# EAGLE schematic untitled (EAGLE 7.7.0)
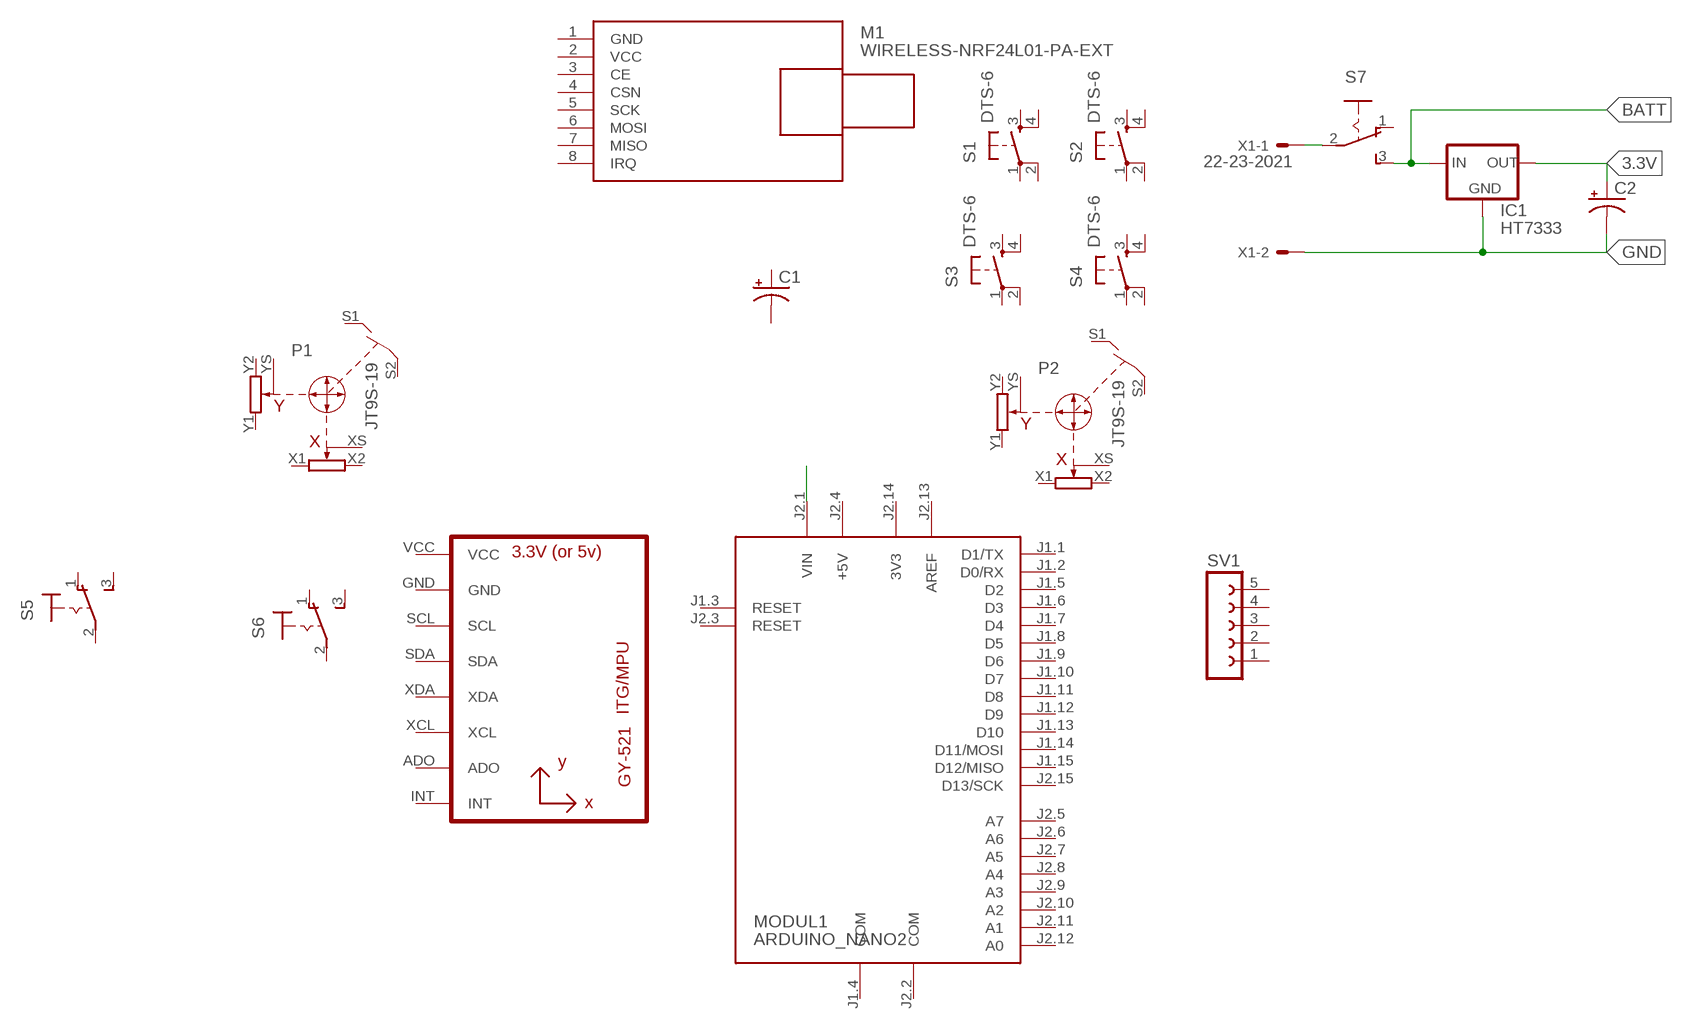
[diagram p0: schematic, sheet 1]

## Parts
C1  CPOL-USE5-8.5  [E5-8,5]
C2  CPOL-USE5-8.5  [E5-8,5]
IC1  HT7333  [SOT-89]
M1  WIRELESS-NRF24L01-PA-EXT  [WIRELESS-NRF24L01-PA-EXT]
MODUL1  ARDUINO_NANO2  [ARDUINO_NANO2]
P1  JT9S-19  [JT9S-1P]
P2  JT9S-19  [JT9S-1P]
S1  DTS-6  [DTS-6]
S2  DTS-6  [DTS-6]
S3  DTS-6  [DTS-6]
S4  DTS-6  [DTS-6]
S5  320-916  [320-916]
S6  320-916  [320-916]
S7  255SB  [255SB]
SV1  FE05-1  [FE05-1]
U1  GY-521MPU6050  [GY-521]
X1  22-23-2021  [22-23-2021]

## Nets
3.3V: C2.+ IC1.1(OUT)
BATT: IC1.3(IN) IC1.4(IN) S7.3(S)
GND: C2.- IC1.2(GND) X1.2
N$1: S7.2(P) X1.1
N$2: MODUL1.J2.1(VIN)
Unconnected: C1.+ C1.- M1.3(CE) M1.4(CSN) M1.5(SCK) M1.6(MOSI) M1.7(MISO) M1.8(IRQ) MODUL1.J1.1(D1/TX) MODUL1.J1.2(D0/RX) MODUL1.J1.3(RESET) MODUL1.J1.5(D2) MODUL1.J1.6(D3) MODUL1.J1.7(D4) MODUL1.J1.8(D5) MODUL1.J1.9(D6) MODUL1.J1.10(D7) MODUL1.J1.11(D8) MODUL1.J1.12(D9) MODUL1.J1.13(D10) MODUL1.J1.14(D11/MOSI) MODUL1.J1.15(D12/MISO) MODUL1.J2.3(RESET) MODUL1.J2.5(A7) MODUL1.J2.6(A6) MODUL1.J2.7(A5) MODUL1.J2.8(A4) MODUL1.J2.9(A3) MODUL1.J2.10(A2) MODUL1.J2.11(A1) MODUL1.J2.12(A0) MODUL1.J2.15(D13/SCK) P1.S1 P1.S2 P1.X1 P1.X2 P1.XS P1.Y1 P1.Y2 P1.YS P2.S1 P2.S2 P2.X1 P2.X2 P2.XS P2.Y1 P2.Y2 P2.YS S1.1 S1.2 S1.3 S1.4 S2.1 S2.2 S2.3 S2.4 S3.1 S3.2 S3.3 S3.4 S4.1 S4.2 S4.3 S4.4 S5.1(O) S5.2(P) S5.3(S) S6.1(O) S6.2(P) S6.3(S) S7.1(O) SV1.1 SV1.2 SV1.3 SV1.4 SV1.5 U1.ADO U1.GND U1.INT U1.SCL U1.SDA U1.VCC U1.XCL U1.XDA

## Power pins joined to a net without a drawn wire
3V3: MODUL1.J2.14(3V3)
+5V: MODUL1.J2.4(+5V)
AREF: MODUL1.J2.13(AREF)
COM: MODUL1.J1.4(COM) MODUL1.J2.2(COM)
GND: M1.1(GND)
VCC: M1.2(VCC)

## Library data of the parts
C1 C2 = rcl:CPOL-US: POLARIZED CAPACITOR, American symbol
IC1 = holtek2:HT73*
M1 = diy-modules:WIRELESS-NRF24L01-PA-EXT: 2.4 GHz Wireless Module based on NRF24L01 chip with preamplifier and external antenna Click here to find device on ebay.com <http://www.ebay.com/sch/nrf24l01+pa+lna+sma>
MODUL1 = arduino2:ARDUINO_NANO2: Arduino Nano2 Auto generated by modulcreator.ulp \;; ANZAHL: 2; MODUL: TRUE; STECKX0: -76200; STECKX1: 76200; STECKY0: 177800; STECKY1: 177800
P1 P2 = jt9s-1p:JT9S-19: Joystick Potentiometer 10k
S1-S4 = switch-tact:DTS-6
S5 S6 = switch:320-916: TOGGLE SWITCH distributor RS Components
S7 = switch:255SB: SLIDING SWITCH Distributor Buerklin, 11G810
SV1 = con-lsta:FE05-1: FEMALE HEADER; OC_FARNELL: unknown; OC_NEWARK: unknown
U1 = gy-521:GY-521
X1 = con-molex:22-23-2021: .100" (2.54mm) Center Header - 2 Pin; MF: MOLEX; MPN: 22-23-2021; OC_FARNELL: 1462926; OC_NEWARK: 25C3832